# Altium schematic sheet USBIO.SchDoc
size A; SheetNumber: 3; SheetTotal: 5
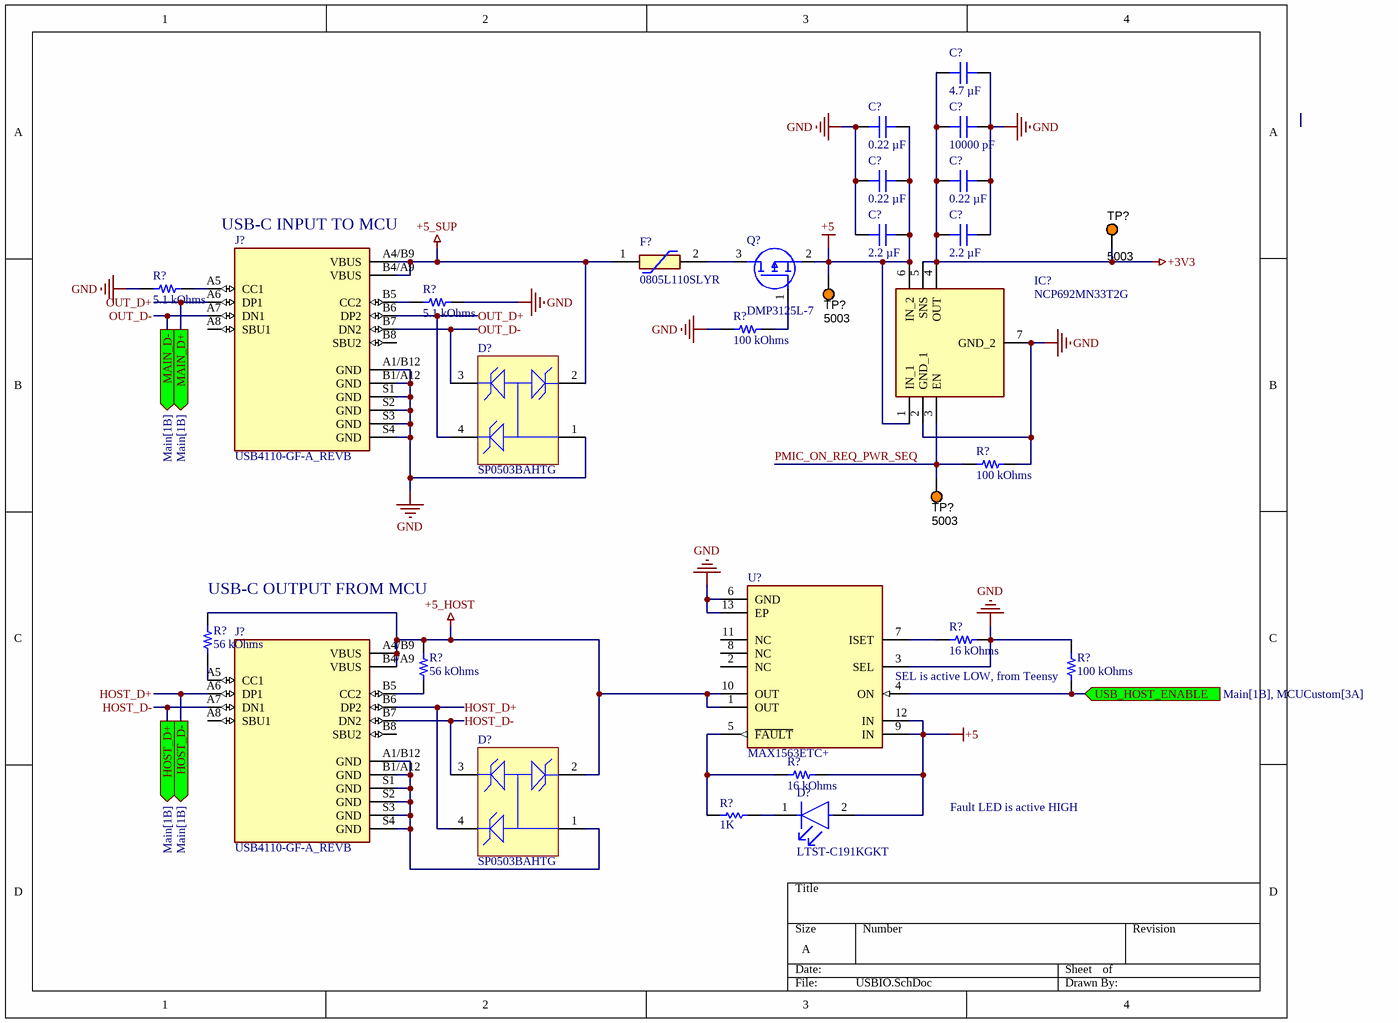
[diagram p0: USBIO.SchDoc]

## Parts
(Parts that share a designator on the sheet are numbered #1, #2 ... from top to bottom, then left to right.)
C?#1  4.7 µF  [CAP 0603_1608]
C?#2  0.22 µF  [CAP 0603_1608]
C?#3  10000 pF  [CAP 0603_1608]
C?#4  0.22 µF  [CAP 0603_1608]
C?#5  0.22 µF  [CAP 0603_1608]
C?#6  2.2 µF  [CAP 0603_1608]
C?#7  2.2 µF  [CAP 0603_1608]
D?#1  SP0503BAHTG  [LFUS-SOT143-4_V]
D?#2  LTST-C191KGKT  [FP-LTST-C191KGKT-MFG]
D?#3  SP0503BAHTG  [LFUS-SOT143-4_V]
F?  0805L110SLYR  [0805L075SLYR]
IC?  NCP692MN33T2G  [SON95P300X300X100-7N]
J?#1  USB4110-GF-A_REVB  [GCT_USB4110-GF-A_REVB]
J?#2  USB4110-GF-A_REVB  [GCT_USB4110-GF-A_REVB]
Q?  DMP3125L-7  [SOT96P240X110-3N]
R?#1  5.1 kOhms  [RES 0603_1608]
R?#2  5.1 kOhms  [RES 0603_1608]
R?#3  100 kOhms  [RES 0603_1608]
R?#4  100 kOhms  [RES 0603_1608]
R?#5  56 kOhms  [RES 0603_1608]
R?#6  16 kOhms  [RES 0603_1608]
R?#7  56 kOhms  [RES 0603_1608]
R?#8  100 kOhms  [RES 0603_1608]
R?#9  16 kOhms  [RES 0603_1608]
R?#10  value 1K  (hidden comment: Resistor)
TP?#1  5003  [KSTN-5003]
TP?#2  5003  [KSTN-5003]
TP?#3  5003  [KSTN-5003]
U?  MAX1563ETC+  [FP-T1244-4-MFG]

## Ports
HOST_D+ (out, see Main[1B]), HOST_D- (out, see Main[1B]), MAIN_D+ (out, see Main[1B]), MAIN_D- (out, see Main[1B]), USB_HOST_ENABLE (in, see Main[1B], MCUCustom[3A])

## Nets
+3V3: C?#1.2 C?#3.2 C?#5.2 C?#7.1 IC?.4(OUT) IC?.5(SNS) TP?#1.1
+5: C?#2.1 C?#4.1 C?#6.2 D?#2.2(A) IC?.1(IN_1) IC?.6(IN_2) Q?.2(S) R?#9.2 TP?#2.1 U?.9(IN) U?.12(IN)
+5_HOST: D?#3.2 J?#2.A4/B9(VBUS) J?#2.B4/A9(VBUS) R?#5.2 R?#7.2 U?.1(OUT) U?.10(OUT)
+5_SUP: D?#1.2 F?.1 J?#1.A4/B9(VBUS) J?#1.B4/A9(VBUS)
GND: C?#1.1 C?#2.2 C?#3.1 C?#4.2 C?#5.1 C?#6.1 C?#7.2 D?#1.1 IC?.2(GND_1) IC?.7(GND_2) J?#1.A1/B12(GND) J?#1.B1/A12(GND) J?#1.S1(GND) J?#1.S2(GND) J?#1.S3(GND) J?#1.S4(GND) R?#1.1 R?#2.2 R?#3.2 R?#4.1 R?#6.2 R?#8.1 U?.3(SEL) U?.6(GND) U?.13(EP)
HOST_D+: D?#3.4 J?#2.A6(DP1) J?#2.B6(DP2) ; port HOST_D-
HOST_D-: D?#3.3 J?#2.A7(DN1) J?#2.B7(DN2) ; port HOST_D+
OUT_D+: D?#1.4 J?#1.A6(DP1) J?#1.B6(DP2) ; port MAIN_D+
OUT_D-: D?#1.3 J?#1.A7(DN1) J?#1.B7(DN2) ; port MAIN_D-
PMIC_ON_REQ_PWR_SEQ: IC?.3(EN) R?#4.2 TP?#3.1
USB_HOST_ENABLE: R?#8.2 U?.4(ON) ; port USB_HOST_ENABLE
NetD?#2_1: D?#2.1(C) R?#10.2
NetD?#3_1: D?#3.1 J?#2.A1/B12(GND) J?#2.B1/A12(GND) J?#2.S1(GND) J?#2.S2(GND) J?#2.S3(GND) J?#2.S4(GND)
NetF?_2: F?.2 Q?.3(D)
NetJ?#1_A5: J?#1.A5(CC1) R?#1.2
NetJ?#1_B5: J?#1.B5(CC2) R?#2.1
NetJ?#2_A5: J?#2.A5(CC1) R?#5.1
NetJ?#2_B5: J?#2.B5(CC2) R?#7.1
NetQ?_1: Q?.1(G) R?#3.1
NetR?#6_1: R?#6.1 U?.7(ISET)
NetR?#9_1: R?#9.1 R?#10.1 U?.5(~{FAULT})

Not connected (* = marked no-connect by the designer): J?#1 A8(SBU1) B8(SBU2); J?#2 A8(SBU1) B8(SBU2); U? 2(NC) 8(NC) 11(NC)

## Notes on the sheet
- (near J?#1) USB-C INPUT TO MCU
- (near R?#5) USB-C OUTPUT FROM MCU
- (near R?#8) SEL is active LOW, from Teensy
- Fault LED is active HIGH

## Library data of the parts
C?#1 = GRM188R61C475KE11D: CAP CER 4.7UF 16V X5R 0603; manufacturer: Murata Electronics; Tolerance: ±10%; Part Number: GRM188R61C475KE11D; Value: 4.7 µF; Applications: General Purpose; Capacitance: 4.7 µF; componentlink1description: Datasheet; componentlink1url: https://search.murata.co.jp/Ceramy/image/img/A01X/G101/ENG/GRM188R61C475KE11-01.pdf; componentlink2description: DigiKey Link; componentlink2url: https://www.digikey.com/en/products/detail/murata-electronics/GRM188R61C475KE11D/4905341; Device Package: 0603 (1608 Metric); lastupdated: 2/6/2023 8:08:52 PM; Lifecycle Status: Active; Minimum Order: 1; Mounting Type: Surface Mount, MLCC; Operating Temperature: -55°C ~ 85°C; Package / Case: 0603 (1608 Metric); packaging: TapeAndReel; partid: 2388; Part Status: Active; price: 0.03; series: GRM; Size / Dimension: 0.063" L x 0.031" W (1.60mm x 0.80mm); Supplier 1: DigiKey; Supplier Part Number 1: 490-10730-1-ND; Temperature Coefficient: X5R; Thickness (Max): 0.037" (0.95mm); Voltage - Rated: 16V
C?#2 C?#4 C?#5 = CC0603KRX7R8BB224: CAP CER 0.22UF 25V X7R 0603; manufacturer: Yageo; Tolerance: ±10%; Part Number: CC0603KRX7R8BB224; Value: 0.22 µF; Applications: General Purpose; Capacitance: 0.22 µF; componentlink1description: Datasheet; componentlink1url: https://www.yageo.com/upload/media/product/productsearch/datasheet/mlcc/UPY-GPHC_X7R_6.3V-to-50V_18.pdf; componentlink2description: DigiKey Link; componentlink2url: https://www.digikey.com/en/products/detail/yageo/CC0603KRX7R8BB224/5195211; Device Package: 0603 (1608 Metric); lastupdated: 2/6/2023 8:08:53 PM; Lifecycle Status: Active; Minimum Order: 1; Mounting Type: Surface Mount, MLCC; Operating Temperature: -55°C ~ 125°C; Package / Case: 0603 (1608 Metric); packaging: TapeAndReel; partid: 2214; Part Status: Active; price: 0.01; series: CC; Size / Dimension: 0.063" L x 0.031" W (1.60mm x 0.80mm); Supplier 1: DigiKey; Supplier Part Number 1: 311-1803-1-ND; Temperature Coefficient: X7R; Thickness (Max): 0.035" (0.90mm); Voltage - Rated: 25V
C?#3 = C0603X103K1RAC3316: CAP CER 0603 10NF 100V X7R; manufacturer: KEMET; Tolerance: ±10%; Part Number: C0603X103K1RAC3316; Value: 10000 pF; Applications: Automotive, Boardflex Sensitive; Capacitance: 10000 pF; componentlink1description: Datasheet; componentlink1url: https://api.kemet.com/component-edge/download/datasheet/C0603X103K1RAC3316.pdf; componentlink2description: DigiKey Link; componentlink2url: https://www.digikey.com/en/products/detail/kemet/C0603X103K1RAC3316/10315782; Device Package: 0603 (1608 Metric); Features: Soft Termination; lastupdated: 2/6/2023 8:08:35 PM; Lifecycle Status: Active; Minimum Order: 1; Mounting Type: Surface Mount, MLCC; Operating Temperature: -55°C ~ 125°C; Package / Case: 0603 (1608 Metric); packaging: TapeAndReel; partid: 8591; Part Status: Active; price: 0.07; Ratings: AEC-Q200; series: SMD Auto X7R VW80808; Size / Dimension: 0.063" L x 0.031" W (1.60mm x 0.80mm); Supplier 1: DigiKey; Supplier Part Number 1: 399-C0603X103K1RAC3316CT-ND; Temperature Coefficient: X7R; Thickness (Max): 0.037" (0.95mm); Voltage - Rated: 100V
C?#6 C?#7 = CC0603ZRY5V7BB225: CAP CER 2.2UF 16V Y5V 0603; manufacturer: Yageo; Temperature Coefficient: Y5V (F); Tolerance: -20%, +80%; Part Number: CC0603ZRY5V7BB225; Value: 2.2 µF; Applications: General Purpose; Capacitance: 2.2 µF; componentlink1description: Datasheet; componentlink1url: http://www.yageo.com/documents/recent/UPY-GPHC_Y5V_6.3V-to-50V_8.pdf; componentlink2description: DigiKey Link; componentlink2url: https://www.digikey.com/en/products/detail/yageo/CC0603ZRY5V7BB225/5883851; Device Package: 0603 (1608 Metric); lastupdated: 2/6/2023 8:08:53 PM; Lifecycle Status: Active; Minimum Order: 1; Mounting Type: Surface Mount, MLCC; Operating Temperature: -30°C ~ 85°C; Package / Case: 0603 (1608 Metric); packaging: TapeAndReel; partid: 2203; Part Status: Active; price: 0.01; series: CC; Size / Dimension: 0.063" L x 0.031" W (1.60mm x 0.80mm); Supplier 1: DigiKey; Supplier Part Number 1: 311-3416-1-ND; Thickness (Max): 0.035" (0.90mm); Voltage - Rated: 16V
D?#1 D?#3 = CMP-2000-05191-1: TVS Diode Array, 30 pF, 30 KV, -40 to 85 degC, 4-Pin SOT143, RoHS, Tape and Reel; Manufacturer: Littelfuse; Direction Type: Uni-Directional; Product Height (mm): 1.05mm; Leakage Current (Max): 0.1uA; Clamping Voltage (Max): 8V; Reverse Stand-off Voltage: 5.5(Min)V; Configuration: Triple; Working Voltage: 5.5V; Product Length (mm): 3.04mm; Working Voltage (Max): 5.5V(Min); Capacitance Value: 30pF; Rad Hardened: No; Number of Elements: 3; Product Depth (mm): 1.4mm; Operating Temperature Max Deg. C: 85C; Suppressor Type: TVS; Operating Temperature Min Deg. C: -40C; Operating Temp Range: -40Cto85C; Mounting: SurfaceMount; Package / Case: SOT-143; Datasheet Version: Dec-13; Package Type: SOT-143; Packaging: TapeandReel; Pin Count: 3+Tab; Operating Temperature Classification: Industrial; Datasheet URL: https://datasheet.ciiva.com/15143/getdatasheetpartid-116020-15143550.pdf; Manufacturer URL: http://www.littelfuse.com/; Leakage Current: 0.1uA; Mounting Style: SurfaceMount; Clamping Voltage: 8V; Polarity: Uni-Directional
D?#2 = CMP-2000-05198-2: LED GREEN CLEAR SMD; Max Power Dissipation: 75mW; Forward Current: 30mA; Reverse Voltage: 5V; Lens Color: Colorless; Forward Voltage: 2V; Dominant Wavelength: 571nm; Number of LEDs: 1; Viewing Angle: 130°; Lens Style: Rectangular; Test Current: 20mA; Luminous Intensity: 35mcd; Wavelength: 574nm; Width: 0.8mm; Case Code (Imperial): 0603; Number of Pins: 2; Lead Free: Lead Free; Packaging: Tape and Reel; Package Quantity: 1; Min Operating Temperature: -55°C; Case/Package: 0603; Length: 1.6mm; Power Dissipation: 75mW; Depth: 0.8mm; Radiation Hardening: No; Mount: Surface Mount; Max Operating Temperature: 85°C; Color: Green; Power Rating: 75mW; Height: 0.55mm; Illumination Color: Green; Case Code (Metric): 1608; Lens Transparency: Clear; Number of Elements: 1
F? = 0805L110SLYR: Resettable Fuse; Manufacturer_Name: LITTELFUSE; Datasheet Link: https://m.littelfuse.com/~/media/electronics/datasheets/resettable_ptcs/littelfuse_ptc_lorho_datasheet.pdf.pdf; Height: 0.75mm; Manufacturer_Part_Number: 0805L110SLYR; Mouser Part Number: 576-0805L110SLYR; Mouser Price/Stock: https://www.mouser.co.uk/ProductDetail/Littelfuse/0805L110SLYR?qs=EWTG4QeKclHL0DPYhJ7mhQ%3D%3D; Arrow Part Number: 0805L110SLYR; Arrow Price/Stock: https://www.arrow.com/en/products/0805l110slyr/littelfuse?region=nac
IC? = NCP692MN33T2G: Integrated Circuit; Manufacturer_Name: onsemi; Datasheet Link: http://www.onsemi.com/pub/Collateral/NCP690-D.PDF; Height: 1mm; Manufacturer_Part_Number: NCP692MN33T2G; Mouser Part Number: 863-NCP692MN33T2G; Mouser Price/Stock: https://www.mouser.co.uk/ProductDetail/onsemi/NCP692MN33T2G?qs=qq0d0g5Qxs2BIvd8Sor9Ug%3D%3D; Arrow Part Number: NCP692MN33T2G; Arrow Price/Stock: https://www.arrow.com/en/products/ncp692mn33t2g/on-semiconductor?region=nac
J?#1 J?#2 = USB4110-GF-A_REVB: USB-C (USB TYPE-C) USB 2.0 Receptacle Connector 24 (16+8 Dummy) Position Surface Mount, Right Angle; Through Hole; MF: GCT; SnapEDA_Link: https://www.snapeda.com/parts/USB4110-GF-A/Global+Connector+Technology/view-part/?ref=snap; Package: None; MP: USB4110-GF-A; Check_prices: https://www.snapeda.com/parts/USB4110-GF-A/Global+Connector+Technology/view-part/?ref=eda; Purchase-URL: https://pricing.snapeda.com/search/part/USB4110-GF-A/?ref=eda; Price: None; Value: *; Availability: In Stock
Q? = DMP3125L-7: MOSFET (P-Channel); Manufacturer_Name: Diodes Inc.; Datasheet Link: http://uk.rs-online.com/web/p/products/1826917; Height: 1.1mm; Manufacturer_Part_Number: DMP3125L-7; Mouser Part Number: 621-DMP3125L-7; Mouser Price/Stock: https://www.mouser.co.uk/ProductDetail/Diodes-Incorporated/DMP3125L-7?qs=W0yvOO0ixfH8ma8MdHfXQA%3D%3D; Arrow Part Number: DMP3125L-7; Arrow Price/Stock: https://www.arrow.com/en/products/dmp3125l-7/diodes-incorporated
R?#1 R?#2 = RMCF0603JG5K10: RES 5.1K OHM 5% 1/10W 0603; Manufacturer: Stackpole Electronics Inc; Power (Watts): 0.1W, 1/10W; Temperature Coefficient: ±200ppm/°C; Part Number: RMCF0603JG5K10; Value: 5.1 kOhms; ComponentLink1Description: Datasheet; ComponentLink1URL: https://www.seielect.com/catalog/sei-packaging.pdf; ComponentLink2Description: DigiKey Link; ComponentLink2URL: https://www.digikey.com/en/products/detail/stackpole-electronics-inc/RMCF0603JG5K10/1712287; Composition: Thick Film; Device Package: 0603 (1608 Metric); Features: Automotive AEC-Q200; Height - Seated (Max): 0.022" (0.55mm); LastUpdated: 2/5/2023 8:28:09 PM; Lifecycle Status: Active; Minimum Order: 1; Number of Terminations: 2; Operating Temperature: -55°C ~ 155°C; Package / Case: 0603 (1608 Metric); Packaging: CutTape; PartId: 5180; Part Status: Active; Price: 0.01; Ratings: AEC-Q200; Resistance: 5.1 kOhms; Series: RMCF; Size / Dimension: 0.061" L x 0.031" W (1.55mm x 0.80mm); Supplier 1: DigiKey; Supplier Part Number 1: RMCF0603JG5K10CT-ND; Supplier Device Package: 0603; Tolerance: ±5%
R?#3 R?#4 R?#8 = AT0603DRD07100KL: RES SMD 100K OHM 0.5% 1/10W 0603; Manufacturer: Yageo; Power (Watts): 0.1W, 1/10W; Temperature Coefficient: ±25ppm/°C; Part Number: AT0603DRD07100KL; Value: 100 kOhms; ComponentLink1Description: Datasheet; ComponentLink1URL: http://www.yageo.com/documents/recent/PYu-AT_51_RoHS_L_5.pdf; ComponentLink2Description: DigiKey Link; ComponentLink2URL: https://www.digikey.com/en/products/detail/yageo/AT0603DRD07100KL/5908403; Composition: Thin Film; Device Package: 0603 (1608 Metric); Features: Anti-Sulfur, Automotive AEC-Q200, Moisture Resistant; Height - Seated (Max): 0.022" (0.55mm); LastUpdated: 2/5/2023 8:28:10 PM; Lifecycle Status: Active; Minimum Order: 1; Number of Terminations: 2; Operating Temperature: -55°C ~ 155°C; Package / Case: 0603 (1608 Metric); Packaging: TapeAndReel; PartId: 4903; Part Status: Active; Price: 0.02; Ratings: AEC-Q200; Resistance: 100 kOhms; Series: AT; Size / Dimension: 0.063" L x 0.031" W (1.60mm x 0.80mm); Supplier 1: DigiKey; Supplier Part Number 1: 311-2103-1-ND; Supplier Device Package: 0603; Tolerance: ±0.5%
R?#5 R?#7 = RT0603DRE0756KL: RES SMD 56K OHM 0.5% 1/10W 0603; Manufacturer: Yageo; Power (Watts): 0.1W, 1/10W; Temperature Coefficient: ±50ppm/°C; Part Number: RT0603DRE0756KL; Value: 56 kOhms; ComponentLink1Description: Datasheet; ComponentLink1URL: https://www.yageo.com/upload/media/product/productsearch/datasheet/rchip/PYu-RT_1-to-0.01_RoHS_L_11.pdf; ComponentLink2Description: DigiKey Link; ComponentLink2URL: https://www.digikey.com/en/products/detail/yageo/RT0603DRE0756KL/1074915; Composition: Thin Film; Device Package: 0603 (1608 Metric); Height - Seated (Max): 0.022" (0.55mm); LastUpdated: 2/5/2023 8:27:54 PM; Lifecycle Status: Active; Minimum Order: 1; Number of Terminations: 2; Operating Temperature: -55°C ~ 155°C; Package / Case: 0603 (1608 Metric); Packaging: TapeAndReel; PartId: 9956; Part Status: Active; Price: 0.01; Resistance: 56 kOhms; Series: RT; Size / Dimension: 0.063" L x 0.031" W (1.60mm x 0.80mm); Supplier 1: DigiKey; Supplier Part Number 1: 311-2622-1-ND; Supplier Device Package: 0603; Tolerance: ±0.5%
R?#6 R?#9 = RMCF0603JT16K0: RES 16K OHM 5% 1/10W 0603; Manufacturer: Stackpole Electronics Inc; Power (Watts): 0.1W, 1/10W; Temperature Coefficient: ±200ppm/°C; Part Number: RMCF0603JT16K0; Value: 16 kOhms; ComponentLink1Description: Datasheet; ComponentLink1URL: https://www.seielect.com/catalog/sei-rmcf_rmcp.pdf; ComponentLink2Description: DigiKey Link; ComponentLink2URL: https://www.digikey.com/en/products/detail/stackpole-electronics-inc/RMCF0603JT16K0/1757955; Composition: Thick Film; Device Package: 0603 (1608 Metric); Features: Automotive AEC-Q200; Height - Seated (Max): 0.022" (0.55mm); LastUpdated: 2/5/2023 8:27:59 PM; Lifecycle Status: Active; Minimum Order: 1; Number of Terminations: 2; Operating Temperature: -55°C ~ 155°C; Package / Case: 0603 (1608 Metric); Packaging: CutTape; PartId: 8268; Part Status: Active; Price: 0.01; Ratings: AEC-Q200; Resistance: 16 kOhms; Series: RMCF; Size / Dimension: 0.061" L x 0.031" W (1.55mm x 0.80mm); Supplier 1: DigiKey; Supplier Part Number 1: RMCF0603JT16K0CT-ND; Supplier Device Package: 0603; Tolerance: ±5%
R?#10 = Resistor: TC1: 0; SimulationGenericComponent: True; TC2: 0
TP?#1-TP?#3 = CMP-002-00037-2: Test Point, Orange, Height 4.6 mm, Tail Length 3 mm, 1-Pin THD, RoHS; Manufacturer: Keystone; Colour: Orange; Packaging: Bulk; Package Description: 1-Pin Through Hole Device, Dia 2.54 mm; Pins: 1; Package Reference: 5003; Datasheet Version: Jun-15; Case/Package: 5003; Mounting Technology: TH; Connector Type: TestPoint; Diameter: 2.54mm; Contact Material: Bronze; Datasheet URL: http://keyelco.com/userAssets/file/M65p56.pdf; Manufacturer URL: http://www.keyelco.com/; Package Quantity: 10; Contact Plating: Tin; RoHS Compliant: True
U? = CMP-05714-000029-1: IC INTERFACE SPECIALIZED 12TQFN; Number of Inputs: 1; Nominal Supply Current: 3uA; Turn-Off Delay Time: 3ms; Turn-On Delay Time: 4ms; Interface: USB; Min Supply Voltage: 4V; Max Output Current: 4A; On-State Resistance: 26R; Max Supply Voltage: 5.5V; RoHS Compliant: Yes; Series: -; Contact Plating: Tin; Package Quantity: 75; Number of Outputs: 1; Radiation Hardening: No; Min Operating Temperature: -40°C; Mount: Surface Mount; Packaging: Rail/Tube; Max Operating Temperature: 85°C; Supply Current: 3uA; Lead Free: Lead Free; Number of Pins: 12